# Altium schematic sheet 2_classyTKL_EC_matrix.SchDoc: ClassyTKL - MX
size A2; Address1: github.com/4pplet/classytkl; Address2: Licence: CERN-OHL-S; Revision: A3; SheetNumber: 2; SheetTotal: 3
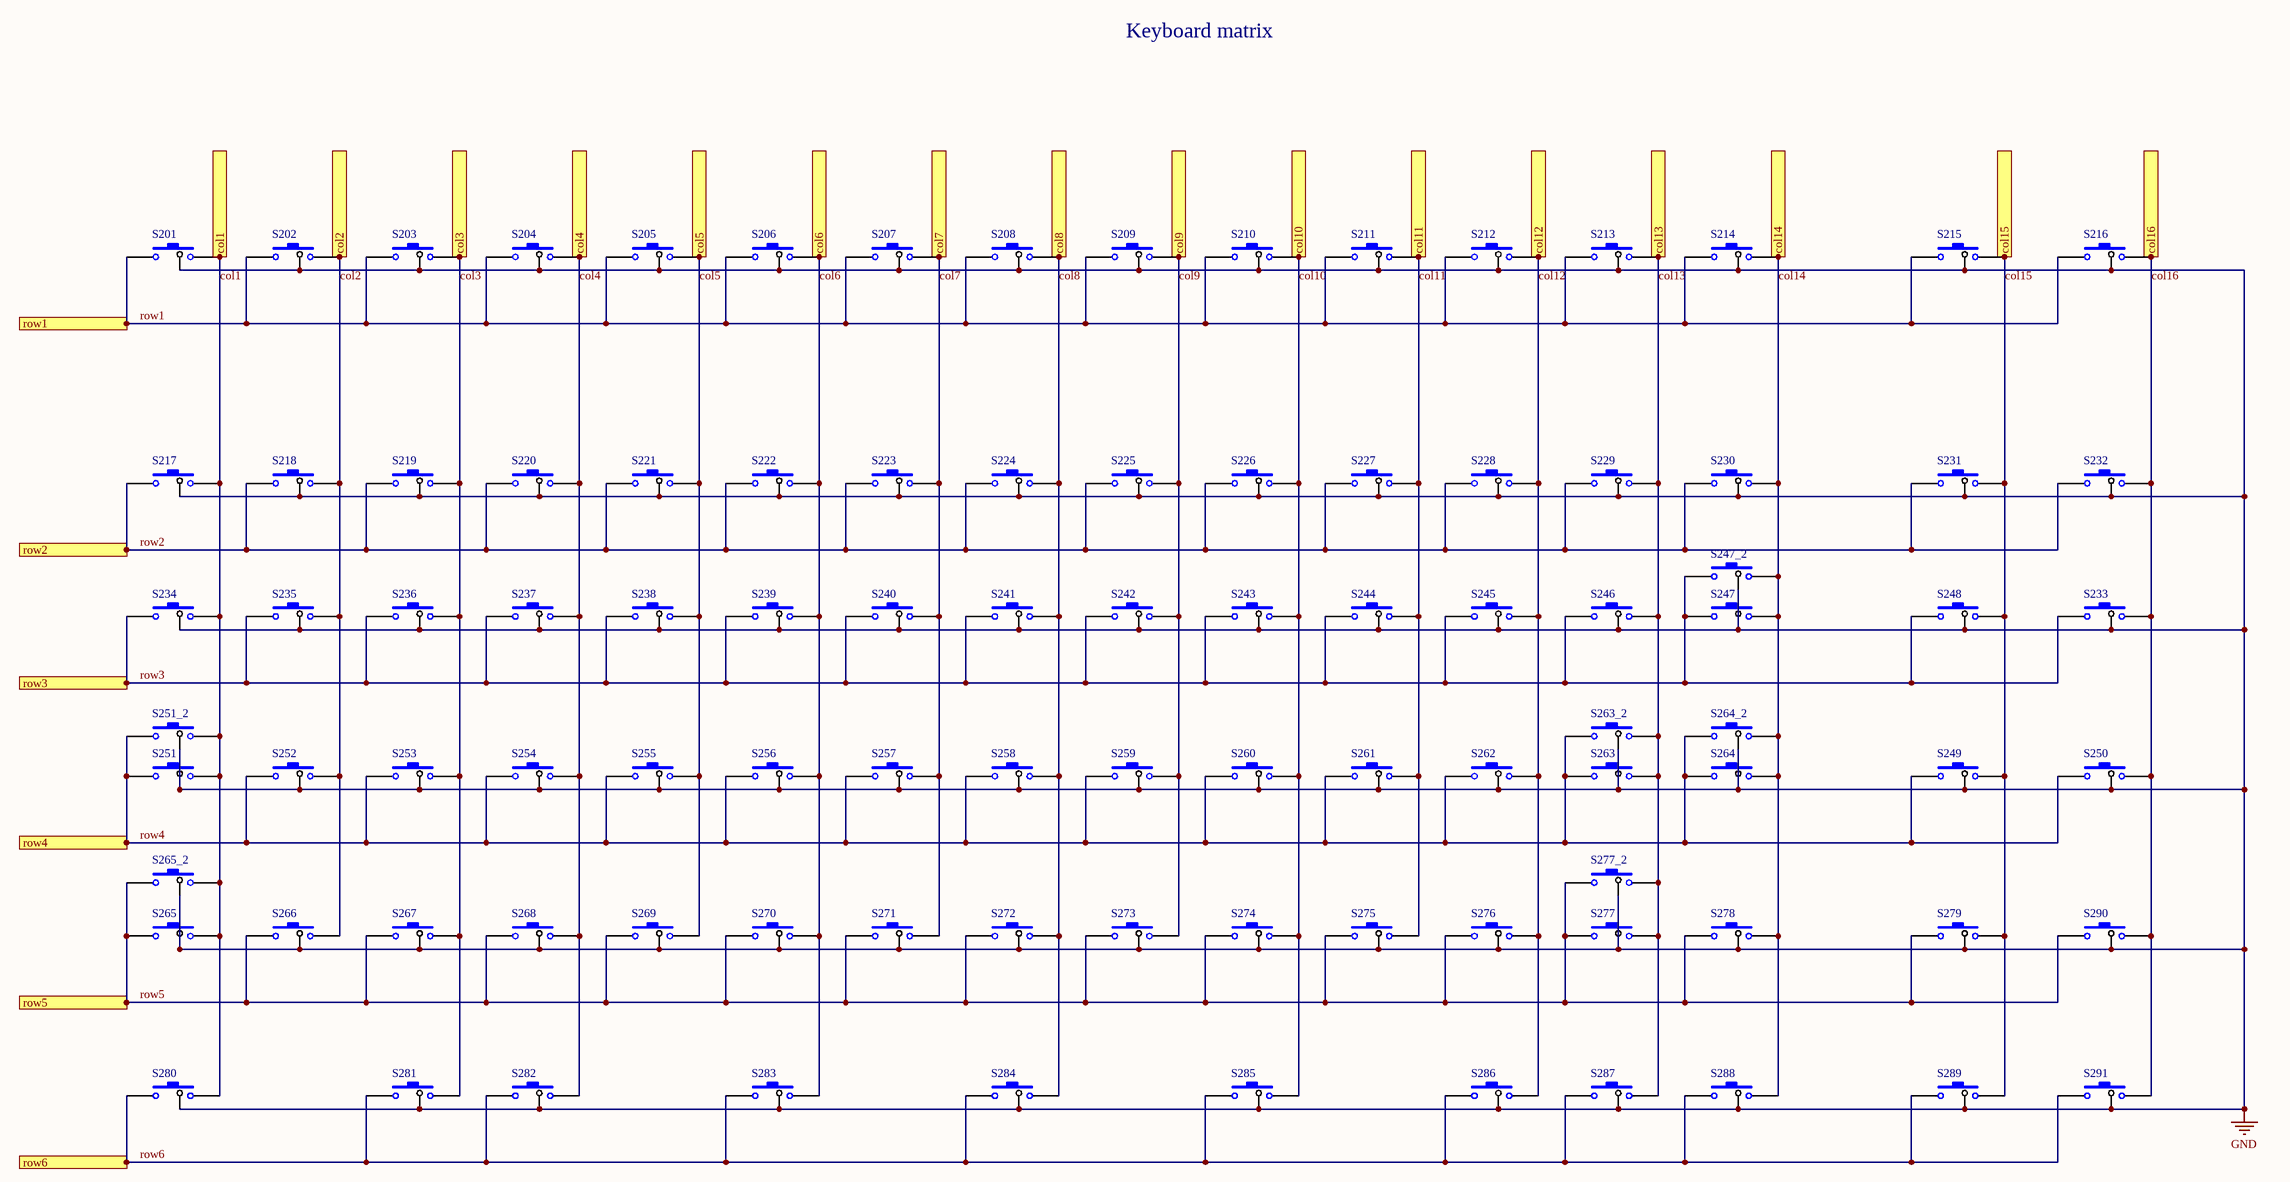
[diagram p0: 2_classyTKL_EC_matrix.SchDoc]

## Parts
S201  SW-PB-3  [Topre]  (value not drawn)
S202  SW-PB-3  [Topre]  (value not drawn)
S203  SW-PB-3  [Topre]  (value not drawn)
S204  SW-PB-3  [Topre]  (value not drawn)
S205  SW-PB-3  [Topre]  (value not drawn)
S206  SW-PB-3  [Topre]  (value not drawn)
S207  SW-PB-3  [Topre]  (value not drawn)
S208  SW-PB-3  [Topre]  (value not drawn)
S209  SW-PB-3  [Topre]  (value not drawn)
S210  SW-PB-3  [Topre]  (value not drawn)
S211  SW-PB-3  [Topre]  (value not drawn)
S212  SW-PB-3  [Topre]  (value not drawn)
S213  SW-PB-3  [Topre]  (value not drawn)
S214  SW-PB-3  [Topre]  (value not drawn)
S215  SW-PB-3  [Topre]  (value not drawn)
S216  SW-PB-3  [Topre]  (value not drawn)
S217  SW-PB-3  [Topre]  (value not drawn)
S218  SW-PB-3  [Topre]  (value not drawn)
S219  SW-PB-3  [Topre]  (value not drawn)
S220  SW-PB-3  [Topre]  (value not drawn)
S221  SW-PB-3  [Topre]  (value not drawn)
S222  SW-PB-3  [Topre]  (value not drawn)
S223  SW-PB-3  [Topre]  (value not drawn)
S224  SW-PB-3  [Topre]  (value not drawn)
S225  SW-PB-3  [Topre]  (value not drawn)
S226  SW-PB-3  [Topre]  (value not drawn)
S227  SW-PB-3  [Topre]  (value not drawn)
S228  SW-PB-3  [Topre]  (value not drawn)
S229  SW-PB-3  [Topre]  (value not drawn)
S230  SW-PB-3  [Topre]  (value not drawn)
S231  SW-PB-3  [Topre]  (value not drawn)
S232  SW-PB-3  [Topre]  (value not drawn)
S233  SW-PB-3  [Topre]  (value not drawn)
S234  SW-PB-3  [Topre]  (value not drawn)
S235  SW-PB-3  [Topre]  (value not drawn)
S236  SW-PB-3  [Topre]  (value not drawn)
S237  SW-PB-3  [Topre]  (value not drawn)
S238  SW-PB-3  [Topre]  (value not drawn)
S239  SW-PB-3  [Topre]  (value not drawn)
S240  SW-PB-3  [Topre]  (value not drawn)
S241  SW-PB-3  [Topre]  (value not drawn)
S242  SW-PB-3  [Topre]  (value not drawn)
S243  SW-PB-3  [Topre]  (value not drawn)
S244  SW-PB-3  [Topre]  (value not drawn)
S245  SW-PB-3  [Topre]  (value not drawn)
S246  SW-PB-3  [Topre]  (value not drawn)
S247  SW-PB-3  [Topre]  (value not drawn)
S247_2  SW-PB-3  [Topre]  (value not drawn)
S248  SW-PB-3  [Topre]  (value not drawn)
S249  SW-PB-3  [Topre]  (value not drawn)
S250  SW-PB-3  [Topre]  (value not drawn)
S251  SW-PB-3  [Topre]  (value not drawn)
S251_2  SW-PB-3  [Topre]  (value not drawn)
S252  SW-PB-3  [Topre]  (value not drawn)
S253  SW-PB-3  [Topre]  (value not drawn)
S254  SW-PB-3  [Topre]  (value not drawn)
S255  SW-PB-3  [Topre]  (value not drawn)
S256  SW-PB-3  [Topre]  (value not drawn)
S257  SW-PB-3  [Topre]  (value not drawn)
S258  SW-PB-3  [Topre]  (value not drawn)
S259  SW-PB-3  [Topre]  (value not drawn)
S260  SW-PB-3  [Topre]  (value not drawn)
S261  SW-PB-3  [Topre]  (value not drawn)
S262  SW-PB-3  [Topre]  (value not drawn)
S263  SW-PB-3  [Topre]  (value not drawn)
S263_2  SW-PB-3  [Topre]  (value not drawn)
S264  SW-PB-3  [Topre]  (value not drawn)
S264_2  SW-PB-3  [Topre]  (value not drawn)
S265  SW-PB-3  [Topre]  (value not drawn)
S265_2  SW-PB-3  [Topre]  (value not drawn)
S266  SW-PB-3  [Topre]  (value not drawn)
S267  SW-PB-3  [Topre]  (value not drawn)
S268  SW-PB-3  [Topre]  (value not drawn)
S269  SW-PB-3  [Topre]  (value not drawn)
S270  SW-PB-3  [Topre]  (value not drawn)
S271  SW-PB-3  [Topre]  (value not drawn)
S272  SW-PB-3  [Topre]  (value not drawn)
S273  SW-PB-3  [Topre]  (value not drawn)
S274  SW-PB-3  [Topre]  (value not drawn)
S275  SW-PB-3  [Topre]  (value not drawn)
S276  SW-PB-3  [Topre]  (value not drawn)
S277  SW-PB-3  [Topre]  (value not drawn)
S277_2  SW-PB-3  [Topre]  (value not drawn)
S278  SW-PB-3  [Topre]  (value not drawn)
S279  SW-PB-3  [Topre]  (value not drawn)
S280  SW-PB-3  [Topre]  (value not drawn)
S281  SW-PB-3  [Topre]  (value not drawn)
S282  SW-PB-3  [Topre]  (value not drawn)
S283  SW-PB-3  [Topre]  (value not drawn)
S284  SW-PB-3  [Topre]  (value not drawn)
S285  SW-PB-3  [Topre]  (value not drawn)
S286  SW-PB-3  [Topre]  (value not drawn)
S287  SW-PB-3  [Topre]  (value not drawn)
S288  SW-PB-3  [Topre]  (value not drawn)
S289  SW-PB-3  [Topre]  (value not drawn)
S290  SW-PB-3  [Topre]  (value not drawn)
S291  SW-PB-3  [Topre]  (value not drawn)

## Ports
col1, col2, col3, col4, col5, col6, col7, col8, col9, col10, col11, col12, col13, col14, col15, col16, row1, row2, row3, row4, row5, row6

## Nets
GND: S201.3 S202.3 S203.3 S204.3 S205.3 S206.3 S207.3 S208.3 S209.3 S210.3 S211.3 S212.3 S213.3 S214.3 S215.3 S216.3 S217.3 S218.3 S219.3 S220.3 S221.3 S222.3 S223.3 S224.3 S225.3 S226.3 S227.3 S228.3 S229.3 S230.3 S231.3 S232.3 S233.3 S234.3 S235.3 S236.3 S237.3 S238.3 S239.3 S240.3 S241.3 S242.3 S243.3 S244.3 S245.3 S246.3 S247.3 S247_2.3 S248.3 S249.3 S250.3 S251.3 S251_2.3 S252.3 S253.3 S254.3 S255.3 S256.3 S257.3 S258.3 S259.3 S260.3 S261.3 S262.3 S263.3 S263_2.3 S264.3 S264_2.3 S265.3 S265_2.3 S266.3 S267.3 S268.3 S269.3 S270.3 S271.3 S272.3 S273.3 S274.3 S275.3 S276.3 S277.3 S277_2.3 S278.3 S279.3 S280.3 S281.3 S282.3 S283.3 S284.3 S285.3 S286.3 S287.3 S288.3 S289.3 S290.3 S291.3
col1: S201.2 S217.2 S234.2 S251.2 S251_2.2 S265.2 S265_2.2 S280.2 ; port col1
col2: S202.2 S218.2 S235.2 S252.2 S266.2 ; port col2
col3: S203.2 S219.2 S236.2 S253.2 S267.2 S281.2 ; port col3
col4: S204.2 S220.2 S237.2 S254.2 S268.2 S282.2 ; port col4
col5: S205.2 S221.2 S238.2 S255.2 S269.2 ; port col5
col6: S206.2 S222.2 S239.2 S256.2 S270.2 S283.2 ; port col6
col7: S207.2 S223.2 S240.2 S257.2 S271.2 ; port col7
col8: S208.2 S224.2 S241.2 S258.2 S272.2 S284.2 ; port col8
col9: S209.2 S225.2 S242.2 S259.2 S273.2 ; port col9
col10: S210.2 S226.2 S243.2 S260.2 S274.2 S285.2 ; port col10
col11: S211.2 S227.2 S244.2 S261.2 S275.2 ; port col11
col12: S212.2 S228.2 S245.2 S262.2 S276.2 S286.2 ; port col12
col13: S213.2 S229.2 S246.2 S263.2 S263_2.2 S277.2 S277_2.2 S287.2 ; port col13
col14: S214.2 S230.2 S247.2 S247_2.2 S264.2 S264_2.2 S278.2 S288.2 ; port col14
col15: S215.2 S231.2 S248.2 S249.2 S279.2 S289.2 ; port col15
col16: S216.2 S232.2 S233.2 S250.2 S290.2 S291.2 ; port col16
row1: S201.1 S202.1 S203.1 S204.1 S205.1 S206.1 S207.1 S208.1 S209.1 S210.1 S211.1 S212.1 S213.1 S214.1 S215.1 S216.1 ; port row1
row2: S217.1 S218.1 S219.1 S220.1 S221.1 S222.1 S223.1 S224.1 S225.1 S226.1 S227.1 S228.1 S229.1 S230.1 S231.1 S232.1 ; port row2
row3: S233.1 S234.1 S235.1 S236.1 S237.1 S238.1 S239.1 S240.1 S241.1 S242.1 S243.1 S244.1 S245.1 S246.1 S247.1 S247_2.1 S248.1 ; port row3
row4: S249.1 S250.1 S251.1 S251_2.1 S252.1 S253.1 S254.1 S255.1 S256.1 S257.1 S258.1 S259.1 S260.1 S261.1 S262.1 S263.1 S263_2.1 S264.1 S264_2.1 ; port row4
row5: S265.1 S265_2.1 S266.1 S267.1 S268.1 S269.1 S270.1 S271.1 S272.1 S273.1 S274.1 S275.1 S276.1 S277.1 S277_2.1 S278.1 S279.1 S290.1 ; port row5
row6: S280.1 S281.1 S282.1 S283.1 S284.1 S285.1 S286.1 S287.1 S288.1 S289.1 S291.1 ; port row6

## Notes on the sheet
- Keyboard matrix
- Title
- Size:
- Date:
- File:
- A2
- Number:
- Time:
- Revision:
- Sheet
- of

## Library data of the parts
S201-S247 S247_2 S248-S251 S251_2 S252-S263 S263_2 S264 S264_2 S265 S265_2 S266-S277 S277_2 S278-S291 = SW-PB-3: Switch; LCSC MFG: DNP; Value: DNP